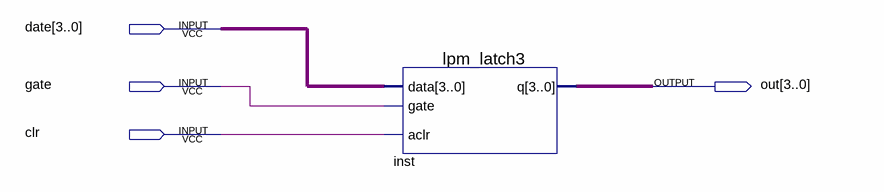
[diagram p0: schematic sheet]
// Quartus schematic test1.bdf as structural Verilog: 1 symbols, 4 pins
module test1 (
  input  [3:0] date,
  input  gate,
  input  clr,
  output [3:0] out
);

  lpm_latch3 inst (.data(date), .gate(gate), .aclr(clr), .q(out));
endmodule
